# Altium project EL6905_2023-07-04T10_27_02_UTC.PrjPcb (part 3 of 3)
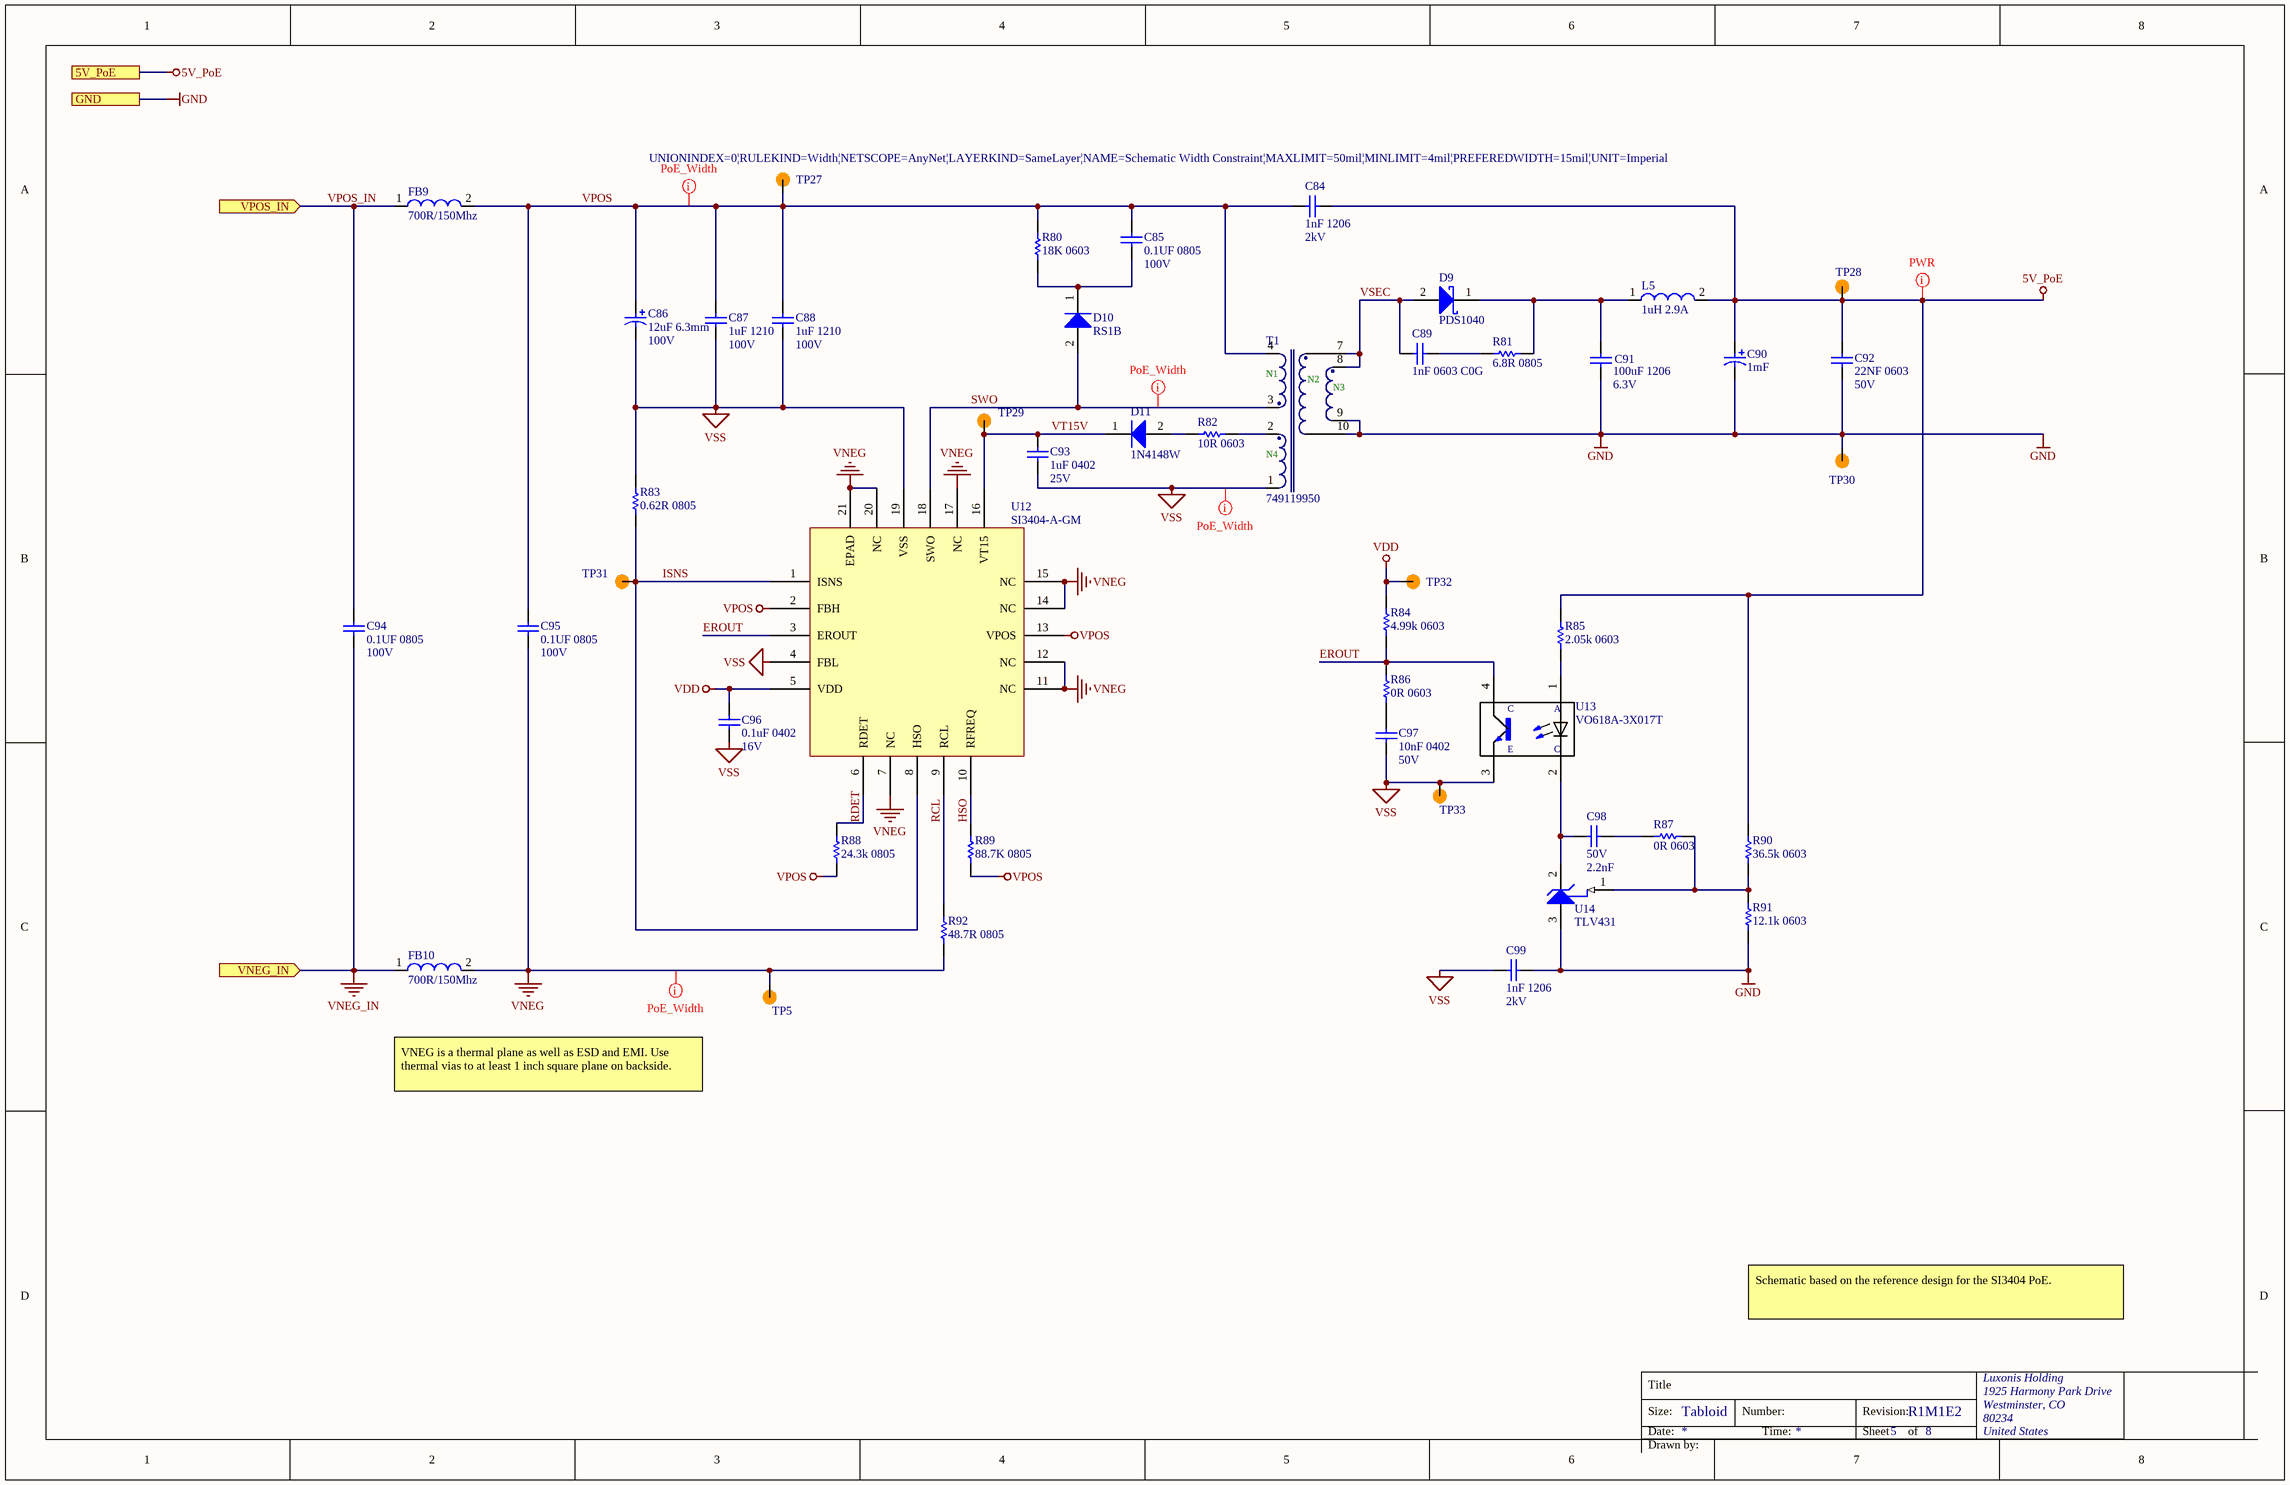
[diagram p9: POE_SI3404.SchDoc]

## Sheet POE_SI3404.SchDoc: =project_title (continued)

### Library data of the parts (continued)
R86 R87 = CRCW06030000Z0EA: RES SMD 0.0R OHM 1% 1/10W 0603; Manufacturer 1: Vishay; Manufacturer Part Number 1: CRCW0603-0000Z0EA; Resistance: 0mR; Power Rating: 100mW; Voltage Rating: 75V; Temperature Coefficient: 100ppm/°C; Tolerance: 5%; Current Rating: 2A; Supplier 1: Digi-Key; Stock 1: 742743; Pricing 1: 1=0.100000, 10=0.034000, 25=0.024400, 50=0.018600, 100=0.013800, 250=0.010480, 500=0.008400, 1000=0.006180 (USD); RoHS: Yes; Mount: Surface Mount; Case/Package: 0603; Weight: 7.1E-05oz; Contact Plating: Tin,Lead; Case Code (Metric): 1608; Case Code (Imperial): 0603; Min Operating Temperature: -55°C; Max Operating Temperature: 155°C; Composition: Thick Film; Termination: SMD/SMT; Packaging: Tape and Reel; Package Quantity: 1; Number of Terminations: 2; Military Standard: Not; Max Power Dissipation: 100mW; Voltage Rating (DC): 75V; Features: Automotive AEC-Q200; Working Voltage: 75V; Length: 1.55mm; Height: 0.02inch; Width: 0.033inch; Depth: 0.85mm; Radiation Hardening: No; Lead Free: Lead Free; REACH SVHC: Unknown; ComponentLink1URL: https://datasheet.ciiva.com/2461/dcrcwe3-2461968.pdf?src-supplier=Digi-Key; ComponentLink1Description: https://datasheet.ciiva.com/2461/dcrcwe3-2461968.pdf?src-supplier=Digi-Key; ComponentLink2URL: https://datasheet.ciiva.com/2461/dcrcwe3-2461969.pdf?src-supplier=Digi-Key; ComponentLink2Description: https://datasheet.ciiva.com/2461/dcrcwe3-2461969.pdf?src-supplier=Digi-Key; ComponentLink3URL: https://datasheet.ciiva.com/2461/dcrcwe3-2461970.pdf?src-supplier=Digi-Key; ComponentLink3Description: https://datasheet.ciiva.com/2461/dcrcwe3-2461970.pdf?src-supplier=Digi-Key; ComponentLink4URL: https://datasheet.ciiva.com/8340/dcrcwe3-8340197.pdf?src-supplier=Avnet; ComponentLink4Description: https://datasheet.ciiva.com/8340/dcrcwe3-8340197.pdf?src-supplier=Avnet; ComponentLink5URL: https://datasheet.ciiva.com/16941/dcrcw-16941302.pdf?src-supplier=Avnet+Europe; ComponentLink5Description: https://datasheet.ciiva.com/16941/dcrcw-16941302.pdf?src-supplier=Avnet+Europe; ComponentLink6URL: https://datasheet.ciiva.com/16199/dcrcwe3-16199063.pdf?src-supplier=Future+Electronics; ComponentLink6Description: https://datasheet.ciiva.com/16199/dcrcwe3-16199063.pdf?src-supplier=Future+Electronics; ComponentLink7URL: https://datasheet.ciiva.com/16725/70201119-16725175.pdf?src-supplier=Allied+Electronics; ComponentLink7Description: https://datasheet.ciiva.com/16725/70201119-16725175.pdf?src-supplier=Allied+Electronics; ComponentLink8URL: https://datasheet.ciiva.com/26316/fld-crcw-e3-data-en-26316615.pdf?src-supplier=Distrelec; ComponentLink8Description: https://datasheet.ciiva.com/26316/fld-crcw-e3-data-en-26316615.pdf?src-supplier=Distrelec; ComponentLink9URL: https://datasheet.ciiva.com/5544/dcrcwe3-109170-5544344.pdf?src-supplier=Mouser; ComponentLink9Description: https://datasheet.ciiva.com/5544/dcrcwe3-109170-5544344.pdf?src-supplier=Mouser; ComponentLink10URL: https://datasheet.ciiva.com/7841/1720486-7841816.pdf?src-supplier=Element14; ComponentLink10Description: https://datasheet.ciiva.com/7841/1720486-7841816.pdf?src-supplier=Element14; ComponentLink11URL: https://datasheet.ciiva.com/7841/1720486-7841817.pdf?src-supplier=Element14; ComponentLink11Description: https://datasheet.ciiva.com/7841/1720486-7841817.pdf?src-supplier=Element14; ComponentLink12URL: https://datasheet.ciiva.com/7841/125364-7841818.pdf?src-supplier=Element14; ComponentLink12Description: https://datasheet.ciiva.com/7841/125364-7841818.pdf?src-supplier=Element14; ComponentLink13URL: https://datasheet.ciiva.com/16721/70201119-16721450.pdf?src-supplier=Allied+Electronics; ComponentLink13Description: https://datasheet.ciiva.com/16721/70201119-16721450.pdf?src-supplier=Allied+Electronics; Supplier Part Number 1: 541-0.0GCT-ND
R88 = CRCW080524K3FKEA: RES SMD 24.3K OHM 1% 1/8W 0805; Manufacturer 1: Vishay; Resistance: 24.3kR; Temperature Coefficient: 100ppm/°C; Power Rating: 125mW; Voltage Rating: 150V; Supplier 1: Digi-Key; Manufacturer Part Number 1: CRCW080524K3FKEA; Stock 1: 7150; Pricing 1: 1=0.10000, 10=0.06200, 100=0.02540, 1000=0.01142, 2500=0.00991 (USD); RoHS: Yes; Mount: Surface Mount; Case/Package: 0805; Number of Pins: 2; Weight: 0.000194oz; Contact Plating: Tin; Case Code (Imperial): 0805; Case Code (Metric): 2012; Min Operating Temperature: -55°C; Max Operating Temperature: 155°C; Tolerance: 1%; Packaging: Tape and Reel; Composition: Thick Film; Package Quantity: 10; Termination: SMD/SMT; Number of Terminations: 2; Max Power Dissipation: 125mW; Features: Automotive AEC-Q200; Military Standard: Not; Voltage Rating (DC): 150V; Working Voltage: 150V; Length: 2mm; Height: 0.45mm; Width: 1.25mm; Depth: 1.25mm; Radiation Hardening: No; Lead Free: Lead Free; REACH SVHC: Unknown; ComponentLink1URL: https://datasheet.ciiva.com/11811/0900766b80d98b26-11811485.pdf?src-supplier=RSComponents; ComponentLink1Description: https://datasheet.ciiva.com/11811/0900766b80d98b26-11811485.pdf?src-supplier=RSComponents; ComponentLink2URL: https://datasheet.ciiva.com/5544/dcrcwe3-109170-5544277.pdf?src-supplier=Mouser; ComponentLink2Description: https://datasheet.ciiva.com/5544/dcrcwe3-109170-5544277.pdf?src-supplier=Mouser; ComponentLink3URL: https://datasheet.ciiva.com/2467/dcrcwe3-2467350.pdf?src-supplier=Digi-Key; ComponentLink3Description: https://datasheet.ciiva.com/2467/dcrcwe3-2467350.pdf?src-supplier=Digi-Key; ComponentLink4URL: https://datasheet.ciiva.com/3258/dcrcwe3-3258365.pdf?src-supplier=Avnet; ComponentLink4Description: https://datasheet.ciiva.com/3258/dcrcwe3-3258365.pdf?src-supplier=Avnet; ComponentLink5URL: https://datasheet.ciiva.com/2467/dcrcwe3-2467351.pdf?src-supplier=Digi-Key; ComponentLink5Description: https://datasheet.ciiva.com/2467/dcrcwe3-2467351.pdf?src-supplier=Digi-Key; ComponentLink6URL: https://datasheet.ciiva.com/2467/dcrcwe3-2467352.pdf?src-supplier=Digi-Key; ComponentLink6Description: https://datasheet.ciiva.com/2467/dcrcwe3-2467352.pdf?src-supplier=Digi-Key; ComponentLink7URL: https://datasheet.ciiva.com/22872/70201119-22872331.pdf?src-supplier=Allied+Electronics; ComponentLink7Description: https://datasheet.ciiva.com/22872/70201119-22872331.pdf?src-supplier=Allied+Electronics; ComponentLink8URL: https://datasheet.ciiva.com/3258/dcrcwe3-3258364.pdf?src-supplier=Avnet; ComponentLink8Description: https://datasheet.ciiva.com/3258/dcrcwe3-3258364.pdf?src-supplier=Avnet; ComponentLink9URL: https://datasheet.ciiva.com/17183/dcrcwe3-17183388.pdf?src-supplier=Avnet+Europe; ComponentLink9Description: https://datasheet.ciiva.com/17183/dcrcwe3-17183388.pdf?src-supplier=Avnet+Europe; ComponentLink10URL: https://datasheet.ciiva.com/22705/1697337-22705870.pdf?src-supplier=Element14; ComponentLink10Description: https://datasheet.ciiva.com/22705/1697337-22705870.pdf?src-supplier=Element14; ComponentLink11URL: https://datasheet.ciiva.com/16202/dcrcwe3-16202447.pdf?src-supplier=Future+Electronics; ComponentLink11Description: https://datasheet.ciiva.com/16202/dcrcwe3-16202447.pdf?src-supplier=Future+Electronics; Supplier 2: Newark; Supplier 3: Mouser; Supplier Part Number 1: 541-24.3KCCT-ND; Supplier Part Number 2: 53K0042; Supplier Part Number 3: 71-CRCW0805-24.3K-E3
R89 = CRCW080588K7FKEA: RES SMD 88.7K OHM 1% 1/8W 0805; Manufacturer 1: Vishay; Resistance: 88.7kR; Temperature Coefficient: 100ppm/°C; Max Power Dissipation: 125mW; Voltage Rating (DC): 150V; Supplier 1: Digi-Key; Manufacturer Part Number 1: CRCW080588K7FKEA; Stock 1: 5728; Pricing 1: 1=0.10000, 10=0.06200, 100=0.02540, 1000=0.01142, 2500=0.00991 (USD); RoHS: Yes; Case/Package: 0805; Number of Pins: 2; Weight: 0.000194oz; Contact Plating: Tin; Case Code (Metric): 2012; Case Code (Imperial): 0805; Min Operating Temperature: -55°C; Max Operating Temperature: 155°C; Tolerance: 1%; Packaging: Tape and Reel; Composition: Thick Film; Package Quantity: 10; Number of Terminations: 2; Features: Automotive AEC-Q200; Termination: SMD/SMT; Power Rating: 125mW; Voltage Rating: 150V; Length: 0.079inch; Height: 0.02inch; Width: 0.049inch; Height - Seated (Max): 0.02inch; Radiation Hardening: No; Lead Free: Lead Free; REACH SVHC: Unknown; ComponentLink1URL: https://datasheet.ciiva.com/7816/1697337-7816134.pdf?src-supplier=Element14; ComponentLink1Description: https://datasheet.ciiva.com/7816/1697337-7816134.pdf?src-supplier=Element14; ComponentLink2URL: https://datasheet.ciiva.com/2496/dcrcwe3-2496001.pdf?src-supplier=Digi-Key; ComponentLink2Description: https://datasheet.ciiva.com/2496/dcrcwe3-2496001.pdf?src-supplier=Digi-Key; ComponentLink3URL: https://datasheet.ciiva.com/2496/dcrcwe3-2496002.pdf?src-supplier=Digi-Key; ComponentLink3Description: https://datasheet.ciiva.com/2496/dcrcwe3-2496002.pdf?src-supplier=Digi-Key; ComponentLink4URL: https://datasheet.ciiva.com/2496/dcrcwe3-2496003.pdf?src-supplier=Digi-Key; ComponentLink4Description: https://datasheet.ciiva.com/2496/dcrcwe3-2496003.pdf?src-supplier=Digi-Key; ComponentLink5URL: https://datasheet.ciiva.com/7816/1697337-7816135.pdf?src-supplier=Element14; ComponentLink5Description: https://datasheet.ciiva.com/7816/1697337-7816135.pdf?src-supplier=Element14; ComponentLink6URL: https://datasheet.ciiva.com/22705/1697337-22705887.pdf?src-supplier=Element14; ComponentLink6Description: https://datasheet.ciiva.com/22705/1697337-22705887.pdf?src-supplier=Element14; Supplier 2: Newark; Supplier 3: Mouser; Supplier Part Number 2: 53K0521; Supplier Part Number 1: 541-88.7KCCT-ND; Supplier Part Number 3: 71-CRCW0805-88.7K-E3
R90 = RC0603FR-0736K5L: RES SMD 36.5K OHM 1% 1/10W 0603; Manufacturer 1: Yageo; Resistance: 36.5kR; Power Rating: 100mW; Voltage Rating: 50V; Temperature Coefficient: 100ppm/°C; Working Voltage: 75V; Supplier 1: Digi-Key; Manufacturer Part Number 1: RC0603FR-0736K5L; Stock 1: 763857; Pricing 1: 1=0.10000, 10=0.02300, 100=0.00940, 1000=0.00421, 2500=0.00366 (USD); RoHS: Yes; Case/Package: 0603; Case Code (Metric): 1608; Case Code (Imperial): 0603; Min Operating Temperature: -55°C; Max Operating Temperature: 155°C; Package Quantity: 1; Tolerance: 1%; Packaging: Tape and Reel; Composition: Thick Film; Number of Terminations: 2; Termination: SMD/SMT; Military Standard: Not; Max Power Dissipation: 100mW; Voltage Rating (DC): 50V; Features: Moisture Resistant; Length: 0.063inch; Height: 0.022inch; Width: 0.031inch; Depth: 0.8mm; Lead Free: Lead Free; ComponentLink1URL: https://datasheet.ciiva.com/2491/pyu-r-int-thick-7-2491306.pdf?src-supplier=Digi-Key; ComponentLink1Description: https://datasheet.ciiva.com/2491/pyu-r-int-thick-7-2491306.pdf?src-supplier=Digi-Key; ComponentLink2URL: https://datasheet.ciiva.com/2491/pyu-r-int-thick-7-2491307.pdf?src-supplier=Digi-Key; ComponentLink2Description: https://datasheet.ciiva.com/2491/pyu-r-int-thick-7-2491307.pdf?src-supplier=Digi-Key; ComponentLink3URL: https://datasheet.ciiva.com/2491/pyu-r-int-thick-7-2491308.pdf?src-supplier=Digi-Key; ComponentLink3Description: https://datasheet.ciiva.com/2491/pyu-r-int-thick-7-2491308.pdf?src-supplier=Digi-Key; Supplier 2: Mouser; Supplier 3: Future Electronics; Supplier Part Number 1: 311-36.5KHRCT-ND; Supplier Part Number 2: 603-RC0603FR-0736K5L; Supplier Part Number 3: RC0603FR-0736K5L-CUTT
R91 = RC0603FR-0712K1L: RES SMD 12.1K OHM 1% 1/10W 0603; Manufacturer 1: Yageo; Power Rating: 100mW; Temperature Coefficient: 100ppm/°C; Resistance: 12.1kR; Voltage Rating: 50V; Supplier 1: Digi-Key; Manufacturer Part Number 1: RC0603FR-0712K1L; Stock 1: 267774; Pricing 1: 1=0.10000, 10=0.02300, 100=0.00940, 1000=0.00421, 2500=0.00366 (USD); RoHS: Yes; Case/Package: 0603; Number of Pins: 2; Case Code (Metric): 1608; Case Code (Imperial): 0603; Min Operating Temperature: -55°C; Max Operating Temperature: 155°C; Tolerance: 1%; Package Quantity: 1; Packaging: Tape and Reel; Composition: Thick Film; Number of Terminations: 2; Termination: SMD/SMT; Military Standard: Not; Max Power Dissipation: 100mW; Voltage Rating (DC): 50V; Features: Moisture Resistant; Length: 1.6mm; Height: 0.022inch; Depth: 0.8mm; Width: 0.031inch; REACH SVHC: No SVHC; Lead Free: Lead Free; ComponentLink1URL: https://datasheet.ciiva.com/2519/pyu-r-int-thick-7-2519216.pdf?src-supplier=Digi-Key; ComponentLink1Description: https://datasheet.ciiva.com/2519/pyu-r-int-thick-7-2519216.pdf?src-supplier=Digi-Key; ComponentLink2URL: https://datasheet.ciiva.com/2519/pyu-r-int-thick-7-2519217.pdf?src-supplier=Digi-Key; ComponentLink2Description: https://datasheet.ciiva.com/2519/pyu-r-int-thick-7-2519217.pdf?src-supplier=Digi-Key; ComponentLink3URL: https://datasheet.ciiva.com/2519/pyu-r-int-thick-7-2519218.pdf?src-supplier=Digi-Key; ComponentLink3Description: https://datasheet.ciiva.com/2519/pyu-r-int-thick-7-2519218.pdf?src-supplier=Digi-Key; ComponentLink4URL: https://datasheet.ciiva.com/15159/getdatasheetpartid-28802-15159207.pdf?src-supplier=Verical; ComponentLink4Description: https://datasheet.ciiva.com/15159/getdatasheetpartid-28802-15159207.pdf?src-supplier=Verical; ComponentLink5URL: https://datasheet.ciiva.com/12558/rc0603-272842-12558574.pdf?src-supplier=Mouser; ComponentLink5Description: https://datasheet.ciiva.com/12558/rc0603-272842-12558574.pdf?src-supplier=Mouser; ComponentLink6URL: https://datasheet.ciiva.com/46395/443971-46395022.pdf?src-supplier=Element14; ComponentLink6Description: https://datasheet.ciiva.com/46395/443971-46395022.pdf?src-supplier=Element14; Supplier 2: Newark; Supplier 3: Mouser; Supplier Part Number 3: 603-RC0603FR-0712K1L; Supplier Part Number 2: 66R2021; Supplier Part Number 1: 311-12.1KHRCT-ND
R92 = RC0805FR-0748R7L: RES SMD 48.7 OHM 1% 1/8W 0805; Manufacturer 1: Yageo; Temperature Coefficient: 100ppm/°C; Power Rating: 125mW; Voltage Rating: 150V; Supplier 1: Digi-Key; Manufacturer Part Number 1: RC0805FR-0748R7L; Stock 1: 11096; Pricing 1: 1=0.10000, 10=0.04000, 100=0.01630, 1000=0.00731, 2500=0.00635 (USD); RoHS: Yes; Case/Package: 0805; Contact Plating: Tin,Matte; Case Code (Metric): 2012; Case Code (Imperial): 0805; Min Operating Temperature: -55°C; Max Operating Temperature: 155°C; Resistance: 48.7R; Tolerance: 1%; Composition: Thick Film; Package Quantity: 1; Packaging: Tape and Reel; Number of Terminations: 2; Termination: SMD/SMT; Military Standard: Not; Max Power Dissipation: 125mW; Voltage Rating (DC): 150V; Features: Moisture Resistant; Length: 2mm; Height: 0.024inch; Width: 0.049inch; Depth: 1.25mm; Radiation Hardening: No; Lead Free: Lead Free; ComponentLink1URL: https://datasheet.ciiva.com/2457/pyu-r-int-thick-7-2457344.pdf?src-supplier=Digi-Key; ComponentLink1Description: https://datasheet.ciiva.com/2457/pyu-r-int-thick-7-2457344.pdf?src-supplier=Digi-Key; ComponentLink2URL: https://datasheet.ciiva.com/2457/pyu-r-int-thick-7-2457345.pdf?src-supplier=Digi-Key; ComponentLink2Description: https://datasheet.ciiva.com/2457/pyu-r-int-thick-7-2457345.pdf?src-supplier=Digi-Key; ComponentLink3URL: https://datasheet.ciiva.com/2457/pyu-r-int-thick-7-2457346.pdf?src-supplier=Digi-Key; ComponentLink3Description: https://datasheet.ciiva.com/2457/pyu-r-int-thick-7-2457346.pdf?src-supplier=Digi-Key; Supplier 2: Mouser; Supplier 3: Arrow; Supplier Part Number 1: 311-48.7CRCT-ND; Supplier Part Number 2: 603-RC0805FR-0748R7L; Supplier Part Number 3: RC0805FR-0748R7L
T1 = 749119950: TRANS FLYBACK POE 127UH SMD; Manufacturer 1: Wurth Electronics; Current Rating: 1.3A; Power Rating: 13W; Max Input Voltage: 57V; Min Input Voltage: 36V; Output Voltage: 5V; Frequency: 500kHz; ComponentLink2URL: http://www.we-online.de/katalog/media/pdf/749119950.pdf; ComponentLink2Description: Datasheet; ComponentLink1Description: Manufacturer URL; ComponentLink1URL: http://www.we-online.com; Supplier 1: Digi-Key; Manufacturer Part Number 1: 749119950; Stock 1: 148; Pricing 1: 1=5.64000, 10=5.44300, 50=5.14100, 100=4.83800 (USD); RoHS: Yes; Mount: Surface Mount; Case/Package: SMD/SMT; Min Operating Temperature: -40°C; Max Operating Temperature: 125°C; Package Quantity: 1; Packaging: Tape and Reel; Inductance: 127uH; Length: 13.5mm; Height: 12.5mm; Width: 17.75mm; Height - Seated (Max): 12.5mm; REACH SVHC: No SVHC; ComponentLink3URL: https://datasheet.ciiva.com/1378/749119950-1378246.pdf?src-supplier=Element14; ComponentLink3Description: https://datasheet.ciiva.com/1378/749119950-1378246.pdf?src-supplier=Element14; ComponentLink4URL: https://datasheet.ciiva.com/5309/749119950-91646-5309801.pdf?src-supplier=Mouser; ComponentLink4Description: https://datasheet.ciiva.com/5309/749119950-91646-5309801.pdf?src-supplier=Mouser; ComponentLink5URL: https://datasheet.ciiva.com/1386/749119950-1386647.pdf?src-supplier=Farnell; ComponentLink5Description: https://datasheet.ciiva.com/1386/749119950-1386647.pdf?src-supplier=Farnell; ComponentLink6URL: https://datasheet.ciiva.com/2940/749119950-2940138.pdf?src-supplier=Digi-Key; ComponentLink6Description: https://datasheet.ciiva.com/2940/749119950-2940138.pdf?src-supplier=Digi-Key; ComponentLink7URL: https://datasheet.ciiva.com/2940/749119950-2940139.pdf?src-supplier=Digi-Key; ComponentLink7Description: https://datasheet.ciiva.com/2940/749119950-2940139.pdf?src-supplier=Digi-Key; Supplier 2: Digi-Key; Supplier 3: Mouser; Supplier Part Number 1: 732-2432-1-ND; Supplier Part Number 2: 732-2432-6-ND; Supplier Part Number 3: 710-749119950
TP5 TP27-TP33 = CMP-015-000000-2: Manufacturer Part Number 1: /; Source: LuxonisMaster.SchLib; Design Item ID: TEST_POINT
U12 = SI3404-A-GM: IC POE CNTRL 1 CHANNEL 20QFN; Manufacturer 1: Silicon Labs; Supplier 1: Digi-Key; Manufacturer Part Number 1: SI3404-A-GM; Stock 1: 1481; Pricing 1: 1=1.46000, 25=1.41040, 100=1.35600, 1000=1.33340 (USD); RoHS: No; ComponentLink1URL: https://www.silabs.com/documents/public/data-sheets/si3404-datasheet.pdf?src-supplier=Digi-Key; ComponentLink1Description: https://www.silabs.com/documents/public/data-sheets/si3404-datasheet.pdf?src-supplier=Digi-Key; Supplier 2: Mouser; Supplier Part Number 1: 336-4270-ND; Supplier Part Number 2: 634-SI3404-A-GM
U13 = VO618A-3X017T: OPTOISOLATOR 5.3KV TRANS 4-SMD; Manufacturer 1: Vishay Semiconductors; Max Power Dissipation: 150mW; Collector Emitter Voltage (VCEO): 80V; Collector Emitter Saturation Voltage: 400mV; Max Collector Current: 50mA; Max Input Current: 60mA; Number of Channels: 1; Reverse Breakdown Voltage: 6V; Forward Voltage: 1.1V; Current Transfer Ratio: 100%; Supplier 1: Digi-Key; Manufacturer Part Number 1: VO618A-3X017T; Stock 1: 28306; Pricing 1: 1=1.04000, 10=0.80900, 100=0.51980, 500=0.43890 (USD); RoHS: Yes; Mount: Surface Mount; Case/Package: SMD/SMT; Number of Pins: 4; Contact Plating: Tin; Min Operating Temperature: -55°C; Max Operating Temperature: 110°C; Packaging: Tape and Reel; Package Quantity: 1; Forward Current: 60mA; Max Output Voltage: 80V; Output Current per Channel: 50mA; Isolation Voltage: 5.3kV; Number of Elements: 1; Power Dissipation: 150mW; Input Current: 60mA; Radiation Hardening: No; REACH SVHC: Unknown; Lead Free: Lead Free; ComponentLink1URL: https://datasheet.ciiva.com/26183/vo618a-26183397.pdf?src-supplier=Avnet+Europe; ComponentLink1Description: https://datasheet.ciiva.com/26183/vo618a-26183397.pdf?src-supplier=Avnet+Europe; ComponentLink2URL: https://datasheet.ciiva.com/2087/vo618a-2087431.pdf?src-supplier=Digi-Key; ComponentLink2Description: https://datasheet.ciiva.com/2087/vo618a-2087431.pdf?src-supplier=Digi-Key; ComponentLink3URL: https://datasheet.ciiva.com/2087/vo618a-2087432.pdf?src-supplier=Digi-Key; ComponentLink3Description: https://datasheet.ciiva.com/2087/vo618a-2087432.pdf?src-supplier=Digi-Key; ComponentLink4URL: https://datasheet.ciiva.com/2087/vo618a-2087433.pdf?src-supplier=Digi-Key; ComponentLink4Description: https://datasheet.ciiva.com/2087/vo618a-2087433.pdf?src-supplier=Digi-Key; Supplier 2: Newark; Supplier 3: Mouser; Supplier Part Number 1: VO618A-3X017TCT-ND; Supplier Part Number 2: 48W3695; Supplier Part Number 3: 78-VO618A-3X017T
U14 = TLV431BCDBZR: IC VREF SHUNT ADJ SOT23-3; Manufacturer 1: Texas Instruments; Tolerance: 0.5%; Max Input Voltage: 7V; Output Voltage: 6V; Max Output Current: 15mA; Temperature Coefficient: 129ppm/°C; Cathode Current: 100uA; Reference Type: Shunt,Adjustable; Number of Channels: 1; Min Input Voltage: 1.24V; Supplier 1: Digi-Key; Manufacturer Part Number 1: TLV431BCDBZR; Stock 1: 3209; Pricing 1: 1=0.92000, 10=0.81200, 100=0.57850, 500=0.46772, 1000=0.35695 (USD); RoHS: Yes; Case/Package: SOT-23; Number of Pins: 3; Min Operating Temperature: -40°C; Max Operating Temperature: 125°C; Packaging: Tape and Reel; Package Quantity: 1; Output Current: 15mA; Max Output Voltage: 6V; Reference Voltage: 6V; Radiation Hardening: No; Lead Free: Lead Free; REACH SVHC: No SVHC; ComponentLink1URL: https://datasheet.ciiva.com/26889/tlv431bcdbzr-26889546.pdf?src-supplier=IIIC; ComponentLink1Description: https://datasheet.ciiva.com/26889/tlv431bcdbzr-26889546.pdf?src-supplier=IIIC; ComponentLink2URL: https://datasheet.ciiva.com/2006/tlv431a-2006546.pdf?src-supplier=Digi-Key; ComponentLink2Description: https://datasheet.ciiva.com/2006/tlv431a-2006546.pdf?src-supplier=Digi-Key; ComponentLink3URL: https://datasheet.ciiva.com/2006/tlv431a-2006547.pdf?src-supplier=Digi-Key; ComponentLink3Description: https://datasheet.ciiva.com/2006/tlv431a-2006547.pdf?src-supplier=Digi-Key; ComponentLink4URL: https://datasheet.ciiva.com/2006/tlv431a-2006548.pdf?src-supplier=Digi-Key; ComponentLink4Description: https://datasheet.ciiva.com/2006/tlv431a-2006548.pdf?src-supplier=Digi-Key; ComponentLink5URL: https://datasheet.ciiva.com/26264/tlv431b-26264234.pdf?src-supplier=Avnet+Europe; ComponentLink5Description: https://datasheet.ciiva.com/26264/tlv431b-26264234.pdf?src-supplier=Avnet+Europe; ComponentLink6URL: https://datasheet.ciiva.com/46397/1887487-46397709.pdf?src-supplier=Element14; ComponentLink6Description: https://datasheet.ciiva.com/46397/1887487-46397709.pdf?src-supplier=Element14; Supplier 2: TI store; Supplier 3: Mouser; Supplier Part Number 1: 296-17569-1-ND; Supplier Part Number 2: TLV431BCDBZR; Supplier Part Number 3: 595-TLV431BCDBZR

## Sheet M8_AUX_CONN.SchDoc: =project_title
size Tabloid; CompanyName: Luxonis Holding; DrawnBy: Eason Lin; Organization: Luxonis Holding; Address1: 1925 Harmony Park Drive; Address2: Westminster, CO; Address3: 80234; Address4: United States; DocumentNumber: D2088000; Revision: R1M1E2; SheetNumber: 8; SheetTotal: 8
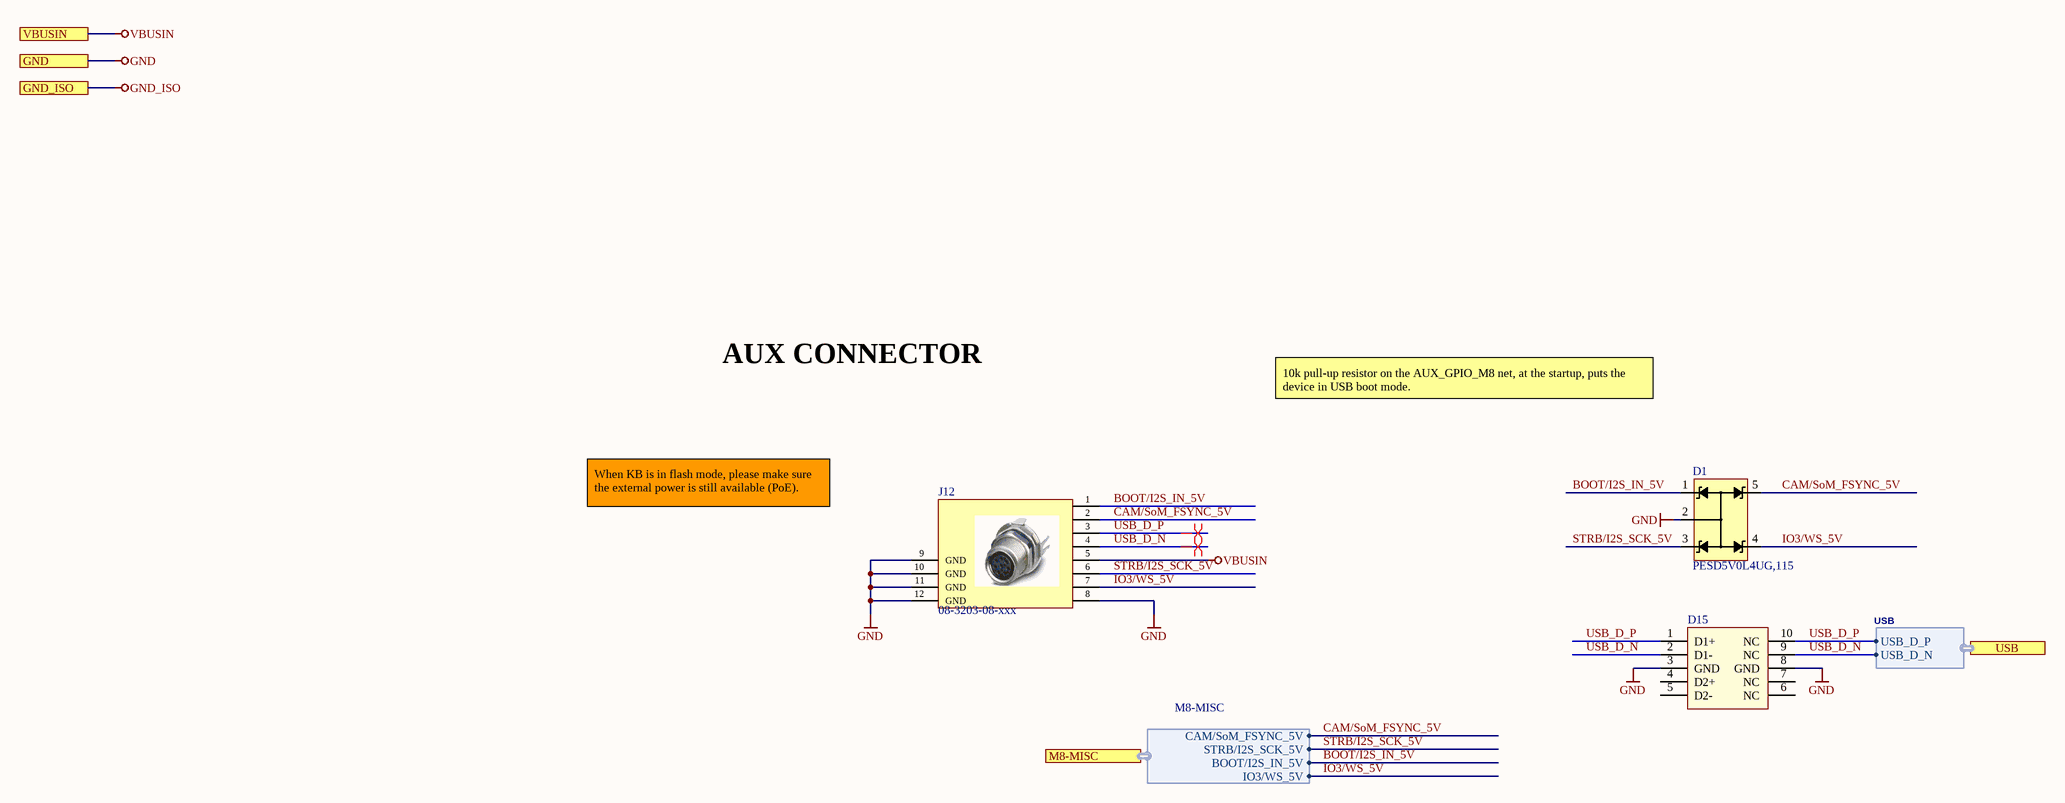
[diagram p4: M8_AUX_CONN.SchDoc]

### Parts
D1  PESD5V0L4UG,115  [PESD3V3L4UG,115]
D15  TPD4EUSB30DQAR  [TPD4EUSB30DQAR]  (value not drawn)
J12  08-3203-08-xxx  [08-3203-08-XXX]

### Ports
GND, GND_ISO, M8-MISC (harness M8-MISC), USB (harness USB), VBUSIN

### Harnesses
USB: USB_D_P, USB_D_N
M8-MISC: CAM/SoM_FSYNC_5V, STRB/I2S_SCK_5V, BOOT/I2S_IN_5V, IO3/WS_5V

### Nets
GND: D1.2 D15.3(GND) D15.8(GND) J12.8 J12.9(GND) J12.10(GND) J12.11(GND) J12.12(GND) ; port GND
GND_ISO: port GND_ISO
VBUSIN: J12.5 ; port VBUSIN
BOOT/I2S_IN_5V: D1.1 J12.1 ; port M8-MISC.BOOT/I2S_IN_5V
CAM/SoM_FSYNC_5V: D1.5 J12.2 ; port M8-MISC.CAM/SoM_FSYNC_5V
IO3/WS_5V: D1.4 J12.7 ; port M8-MISC.IO3/WS_5V
STRB/I2S_SCK_5V: D1.3 J12.6 ; port M8-MISC.STRB/I2S_SCK_5V
USB_D_N: D15.2(D1-) D15.9(NC) J12.4 ; port USB.USB_D_N
USB_D_P: D15.1(D1+) D15.10(NC) J12.3 ; port USB.USB_D_P

Not connected (* = marked no-connect by the designer): D15 4(D2+) 5(D2-) 6(NC) 7(NC)

### Layout directives
differential pair; net class USB2; differential pair class 90ohm: USB_D_N, USB_D_P

### Notes on the sheet
- AUX CONNECTOR
- 10k pull-up resistor on the AUX_GPIO_M8 net, at the startup, puts the device in USB boot mode.
- When KB is in flash mode, please make sure the external power is still available (PoE).
- Title
- Size:
- Date:
- Tabloid
- Number:
- Time:
- Revision:
- Sheet
- of
- Drawn by:

### Library data of the parts
D1 = CMP-097-000002-2: TVS DIODE 5V 12V 5TSSOP; Manufacturer 1: Nexperia; Manufacturer Part Number 1: PESD5V0L4UG,115; Category: ESD and Circuit Protection ICs
D15 = CMP-008-000011-2: TVS DIODE 5.5V 8V 10SON 8V Clamp 1A (8/20µs) Ipp Tvs Diode Surface Mount 10-USON (2.5x1); Manufacturer 1: Texas Instruments; Forward Current: 5A; Manufacturer Part Number 1: TPD4EUSB30DQAR; Min Operating Temperature: -40°C; Max Operating Temperature: 85°C; Clamping Voltage: 8V
J12 = CMP-002-00116-2: M8 Circular Connector; Manufacturer 1: KingTop; RoHS: Yes; Category: Circular Connectors; Contact Finish - Mating: NOT SPECIFIED; Connector Type: Circular; REACH SVHC: No SVHC; RoHS Compliant: Yes; ComponentLink1URL: https://datasheet.ciiva.com:443/pdfs/VipMasterIC/IC/PCON/PCON-S-A0001961096/PCON-S-A0001960825-1.pdf?src-supplier=IHS+Markit; ComponentLink1Description: https://datasheet.ciiva.com:443/pdfs/VipMasterIC/IC/PCON/PCON-S-A0001961096/PCON-S-A0001960825-1.pdf?src-supplier=IHS+Markit; ComponentLink2URL: https://datasheet.ciiva.com/29221/1456132-29221494.pdf?src-supplier=Digi-Key; ComponentLink2Description: https://datasheet.ciiva.com/29221/1456132-29221494.pdf?src-supplier=Digi-Key; ComponentLink3URL: https://datasheet.ciiva.com/41451/718258-da-01-de-sens-akt-einbaubuch-6pol-1456132-20-st-41451463.pdf?src-supplier=Conrad; ComponentLink3Description: https://datasheet.ciiva.com/41451/718258-da-01-de-sens-akt-einbaubuch-6pol-1456132-20-st-41451463.pdf?src-supplier=Conrad; Manufacturer Part Number 1: 08-3203-08-XXX; Stock 1: 11; Pricing 1: 1=26,56000, 10=24,43500, 50=22,57600, 100=21,51360, 250=20,18568 (USD); Design Item ID: 08-3203-08-xxx; Source: NG9097.SchLib; Pins: 8

## Sheet BTB_CONN.SchDoc: =project_title
size Tabloid; CompanyName: Luxonis Holding; DrawnBy: Eason Lin; Organization: Luxonis Holding; Address1: 1925 Harmony Park Drive; Address2: Westminster, CO; Address3: 80234; Address4: United States; DocumentNumber: D2088000; Revision: R1M1E2; SheetNumber: 3; SheetTotal: 8
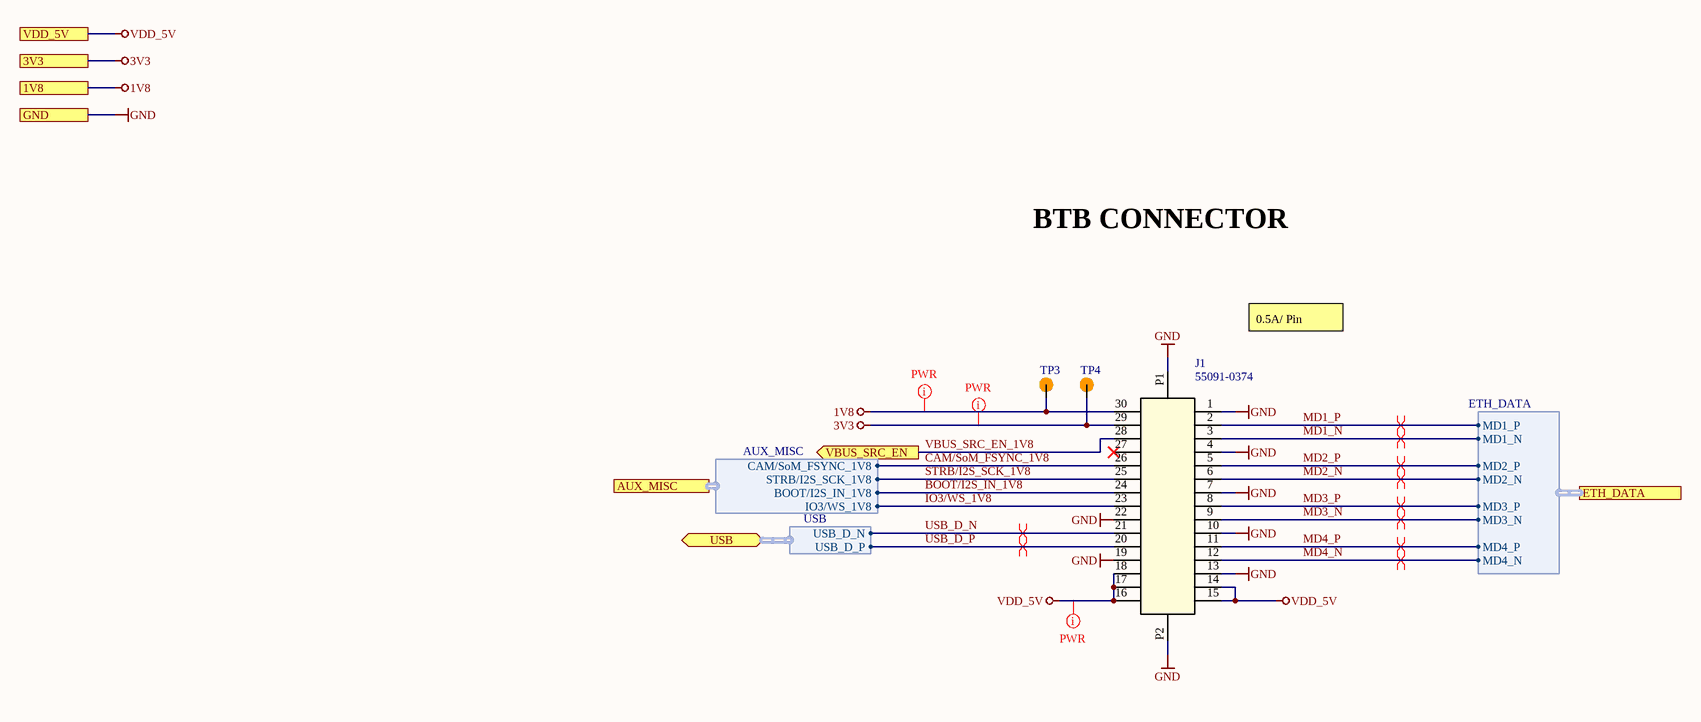
[diagram p5: BTB_CONN.SchDoc]

### Parts
J1  55091-0374  [CON_550910374]
TP3  TP100_200_NS  [TP075_150_NS]  (value not drawn)  (no BOM)
TP4  TP100_200_NS  [TP075_150_NS]  (value not drawn)  (no BOM)

### Ports
1V8, 3V3, AUX_MISC (harness AUX_MISC), ETH_DATA (harness ETH_DATA), GND, USB (bidir, harness USB), VBUS_SRC_EN (out), VDD_5V

### Harnesses
ETH_DATA: MD1_P, MD1_N, MD2_P, MD2_N, MD3_P, MD3_N, MD4_P, MD4_N
USB: USB_D_P, USB_D_N
AUX_MISC: CAM/SoM_FSYNC_1V8, STRB/I2S_SCK_1V8, BOOT/I2S_IN_1V8, IO3/WS_1V8

### Nets
1V8: J1.30 TP3.1 ; port 1V8
3V3: J1.29 TP4.1 ; port 3V3
GND: J1.1 J1.4 J1.7 J1.10 J1.13 J1.19 J1.22 J1.P1 J1.P2 ; port GND
VDD_5V: J1.14 J1.15 J1.16 J1.17 J1.18 ; port VDD_5V
BOOT/I2S_IN_1V8: J1.24 ; port AUX_MISC.BOOT/I2S_IN_1V8
CAM/SoM_FSYNC_1V8: J1.26 ; port AUX_MISC.CAM/SoM_FSYNC_1V8
IO3/WS_1V8: J1.23 ; port AUX_MISC.IO3/WS_1V8
MD1_N: J1.3 ; port ETH_DATA.MD1_N
MD1_P: J1.2 ; port ETH_DATA.MD1_P
MD2_N: J1.6 ; port ETH_DATA.MD2_N
MD2_P: J1.5 ; port ETH_DATA.MD2_P
MD3_N: J1.9 ; port ETH_DATA.MD3_N
MD3_P: J1.8 ; port ETH_DATA.MD3_P
MD4_N: J1.12 ; port ETH_DATA.MD4_N
MD4_P: J1.11 ; port ETH_DATA.MD4_P
STRB/I2S_SCK_1V8: J1.25 ; port AUX_MISC.STRB/I2S_SCK_1V8
USB_D_N: J1.21 ; port USB.USB_D_N
USB_D_P: J1.20 ; port USB.USB_D_P
VBUS_SRC_EN_1V8: J1.28 ; port VBUS_SRC_EN

Not connected (* = marked no-connect by the designer): J1 27*

### Layout directives
differential pair; net class USB2; differential pair class 90ohm: USB_D_N, USB_D_P
differential pair; net class ETH; differential pair class 100ohm: MD1_N, MD1_P, MD2_N, MD2_P, MD3_N, MD3_P, MD4_N, MD4_P
net class PWR; Current Rating: 3A: VDD_5V
net class PWR; Current Rating: 100mA: 1V8, 3V3

### Notes on the sheet
- BTB CONNECTOR
- 0.5A/ Pin
- Title
- Size:
- Date:
- Tabloid
- Number:
- Time:
- Revision:
- Sheet
- of
- Drawn by:

### Library data of the parts
J1 = CMP-00021-4: CONN, Board-to-Board Connector, Mezzanine, 0.635mm pitch, 2x15, 30 positions, Receptacle, Mated height 12mm; Manufacturer 1: Molex; Max Current Rating: 500mA; Voltage Rating: 100V; Manufacturer Part Number 1: 55091-0374; Max Operating Temperature: 105°C; Connector Type: Mezzanine; Gender: Receptacle; Min Operating Temperature: -55°C; Pins: 30; System: Connector
TP3 TP4 = CMP-015-000000-2: Manufacturer Part Number 1: /; Source: LuxonisMaster.SchLib; Design Item ID: TEST_POINT

## Sheet POWER CONTROL.SchDoc: =project_title
size Tabloid; CompanyName: Luxonis Holding; DrawnBy: Eason Lin; Organization: Luxonis Holding; Address1: 1925 Harmony Park Drive; Address2: Westminster, CO; Address3: 80234; Address4: United States; DocumentNumber: D2088000; Revision: R1M1E2; SheetNumber: 4; SheetTotal: 8
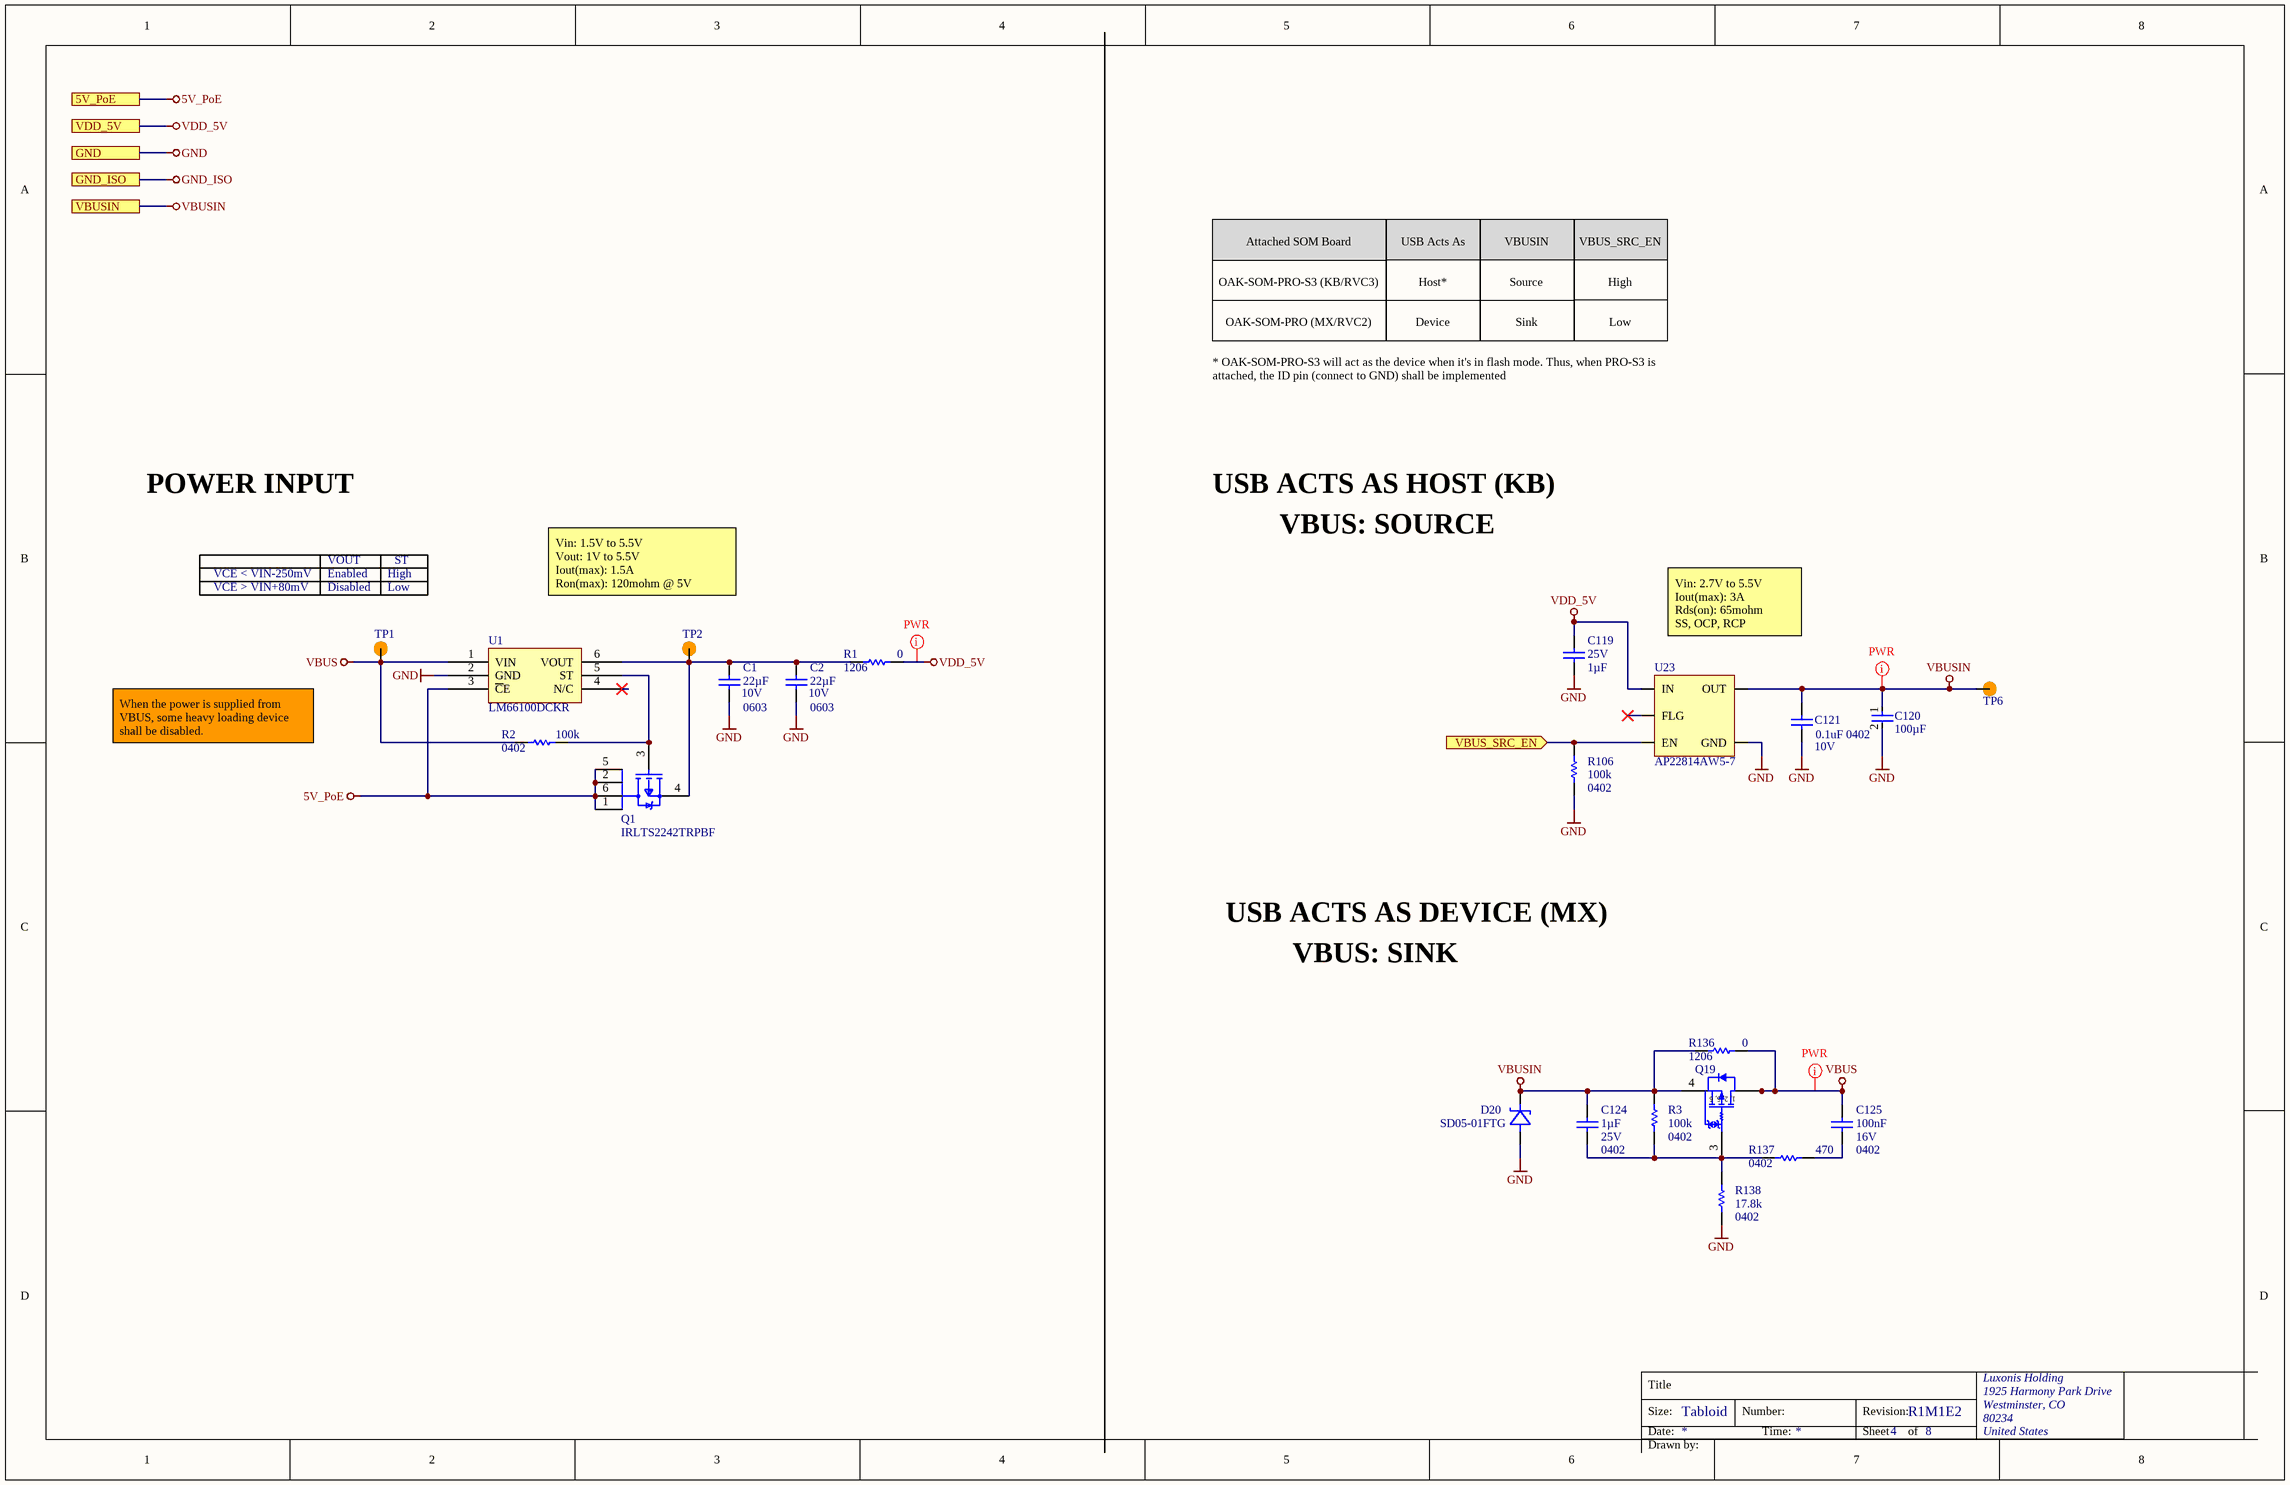
[diagram p6: POWER CONTROL.SchDoc]

### Parts
C1  value 22µF  Voltage Rating: 10V  Case/Package: 0603  [CAPC0603(1608)100_N]  (hidden comment: GRM188R61A226ME15D)
C2  value 22µF  Voltage Rating: 10V  Case/Package: 0603  [CAPC0603(1608)100_N]  (hidden comment: GRM188R61A226ME15D)
C119  value 1µF  Voltage Rating: 25V  [CAPC0402(1005)70_N]  (hidden comment: GRM155R61E105KA12D)
C120  value 100µF  [FP-C1210C107M8PACTU-MFG]  (hidden comment: C1210C107M8PACTU)
C121  0.1uF 0402  Voltage Rating: 10V  [CAPC0402(1005)70_N]
C124  value 1µF  Voltage Rating: 25V  Case/Package: 0402  [CAPC0402(1005)70_N]  (hidden comment: GRM155R61E105KA12D)
C125  value 100nF  Voltage Rating: 16V  Case/Package: 0402  [CAPC0402(1005)60_N]  (hidden comment: CL05B104KO5NFNC)
D20  SD05-01FTG  [SD05-01FTG-Footprint-1]
Q1  IRLTS2242TRPBF  [TSOP-6-MFG]
Q19  NTJS4151PT1G  [ONSC-SC70-6-419B-02_W_V]  (value not drawn)
R1  value 0  Case/Package: 1206  [RESC3116X70X50ML13T20]  (hidden comment: ERJ8GEY0R00V)
R2  value 100k  Case/Package: 0402  [RESC0402(1005)_L]  (hidden comment: RC0402FR-07100KL)
R3  value 100k  Case/Package: 0402  [RESC0402(1005)_L]  (hidden comment: RC0402FR-07100KL)
R106  value 100k  Case/Package: 0402  [RESC0402(1005)_L]  (hidden comment: RC0402FR-07100KL)
R136  value 0  Case/Package: 1206  [RESC3116X70X50ML13T20]  (hidden comment: ERJ8GEY0R00V)
R137  value 470  Case/Package: 0402  [RESC0402(1005)_L]  (hidden comment: CRCW0402470RFKED)
R138  value 17.8k  Case/Package: 0402  [RESC0402(1005)_L]  (hidden comment: ERJ-2RKF1782X)
TP1  TP100_200_NS  [TP075_150_NS]  (value not drawn)  (no BOM)
TP2  TP100_200_NS  [TP075_150_NS]  (value not drawn)  (no BOM)
TP6  TP100_200_NS  [TP075_150_NS]  (value not drawn)  (no BOM)
U1  LM66100DCKR  [LM66100DCKR]
U23  AP22814AW5-7  [AP22814AW5-7-Footprint-1]

### Ports
5V_PoE, GND, GND_ISO, VBUS_SRC_EN (in), VBUSIN, VDD_5V

### Nets
5V_PoE: Q1.1(D) Q1.2(D) Q1.5(D) Q1.6(D) U1.3(~{C}E) ; port 5V_PoE
GND: C1.1 C2.1 C119.1 C120.2 C121.1 D20.1 R106.2 R138.1 U1.2(GND) U23.2(GND) ; port GND
GND_ISO: port GND_ISO
VBUS: C125.2 Q19.1(D) Q19.2(D) Q19.5(D) Q19.6(D) R2.2 R136.2 TP1.1 U1.1(VIN)
VBUSIN: C120.1 C121.2 C124.2 D20.2 Q19.4(S) R3.2 R136.1 TP6.1 U23.1(OUT) ; port VBUSIN
VDD_5V: C119.2 R1.2 U23.5(IN) ; port VDD_5V
VBUS_SRC_EN_1V8: R106.1 U23.4(EN) ; port VBUS_SRC_EN
NetC1_2: C1.2 C2.2 Q1.4(S) R1.1 TP2.1 U1.6(VOUT)
NetC124_1: C124.1 Q19.3(G) R3.1 R137.1 R138.2
NetC125_1: C125.1 R137.2
NetQ1_3: Q1.3(G) R2.1 U1.5(ST)

Not connected (* = marked no-connect by the designer): U1 4(N/C)*; U23 3(FLG)*

### Layout directives
net class PWR; Current Rating: 1.5A: VBUS, VBUSIN
net class PWR; Current Rating: 3A: VDD_5V

### Notes on the sheet
- OAK-SOM-PRO-S3 (KB/RVC3)
- Attached SOM Board
- USB Acts As
- Host*
- VBUSIN
- Source
- VBUS_SRC_EN
- High
- OAK-SOM-PRO (MX/RVC2)
- Device
- Sink
- Low
- * OAK-SOM-PRO-S3 will act as the device when it's in flash mode. Thus, when PRO-S3 is attached, the ID pin (connect to GND) shall be implemented
- POWER INPUT
- USB ACTS AS HOST (KB)
- VOUT
- ST
- VBUS: SOURCE
- VCE < VIN-250mV
- VCE > VIN+80mV
- Enabled
- Disabled
- Vin: 1.5V to 5.5V
  Vout: 1V to 5.5V
  Iout(max): 1.5A
  Ron(max): 120mohm @ 5V
- Vin: 2.7V to 5.5V
  Iout(max): 3A
  Rds(on): 65mohm
  SS, OCP, RCP
- When the power is supplied from VBUS, some heavy loading device shall be disabled.
- USB ACTS AS DEVICE (MX)
- VBUS: SINK
- Title
- Size:
- Date:
- Tabloid
- Number:
- Time:
- Revision:
- Sheet
- of
- Drawn by:
- (in symbol CMP-061-000004-2) 1, 2, 5, 6

### Library data of the parts
C1 C2 = CMP-108-000020-4: CAP CER 22UF 10V X5R 0603 20%; Manufacturer 1: Murata; Tolerance: 20%; Max Operating Temperature: 85°C; ComponentLink1Description: https://datasheet.ciiva.com/46444/1769893-46444975.pdf?src-supplier=Element14; Min Operating Temperature: -55°C; Manufacturer Part Number 1: GRM188R61A226ME15D; Mounting Technology: SMT; Depth: 0.8mm; Design Item ID: GRM188R61A226ME15D; Height: 0.8mm; Dielectric: X5R; Width: 0.8mm; Length: 1.6mm; ComponentLink1URL: https://datasheet.ciiva.com/46444/1769893-46444975.pdf?src-supplier=Element14
C119 C124 = CMP-108-000014-5: CAP CER 1UF 25V X5R 0402 10%; Manufacturer 1: Murata; ComponentLink2Description: https://datasheet.ciiva.com/7719/1666664-7719006.pdf?src-supplier=Element14; ComponentLink2URL: https://datasheet.ciiva.com/7719/1666664-7719006.pdf?src-supplier=Element14; Max Operating Temperature: 85°C; Depth: 0.5mm; Mounting Technology: SMT; ComponentLink1URL: https://datasheet.ciiva.com/22732/1666664-22732122.pdf?src-supplier=Element14; Length: 1mm; ComponentLink1Description: https://datasheet.ciiva.com/22732/1666664-22732122.pdf?src-supplier=Element14; Manufacturer Part Number 1: GRM155R61E105KA12D; Tolerance: 10%; Design Item ID: GRM155R61E105KA12D; Dielectric: X5R; Min Operating Temperature: -55°C; Height: 0.5mm; Width: 0.5mm
  C119: Case/Package: 0402
C120 = CMP-001-00121-3: CAP CER 100UF 10V X5R 1210 20%; Manufacturer 1: Kemet; Capacitor Type: Ceramic; Manufacturer Part Number 1: C1210C107M8PACTU; Mounting Technology: SMT; Dielectric: X5R; Tolerance: 20%; Min Operating Temperature: -55°C; Case/Package: 1210; Voltage Rating: 10V; Max Operating Temperature: 85°C
C121 = GRM155R71A104JA01D: CAP CER 0.1UF 10V X7R 0402 5%; Manufacturer 1: Murata; Capacitance: 100nF; Supplier 1: Digi-Key; Manufacturer Part Number 1: GRM155R71A104JA01D; Stock 1: 1346709; Pricing 1: 1=0.10000, 10=0.02500, 100=0.01130, 500=0.00806, 1000=0.00633, 2500=0.00575, 5000=0.00529 (USD); RoHS: Yes; Mount: Surface Mount; Case/Package: 0402; Case Code (Imperial): 0402; Case Code (Metric): 1005; Min Operating Temperature: -55°C; Max Operating Temperature: 125°C; Tolerance: 5%; Packaging: Tape and Reel; Voltage Rating (DC): 10V; Dielectric: X7R; Package Quantity: 10000; Termination: SMD/SMT; Length: 1mm; Height: 0.5mm; Width: 0.02inch; Thickness: 0.022inch; Depth: 0.5mm; Radiation Hardening: No; Lead Free: Lead Free; ComponentLink1URL: https://datasheet.ciiva.com/5411/product-5411135.pdf?src-supplier=Mouser; ComponentLink1Description: https://datasheet.ciiva.com/5411/product-5411135.pdf?src-supplier=Mouser; ComponentLink2URL: https://datasheet.ciiva.com/11618/c02e-11618821.pdf?src-supplier=Avnet; ComponentLink2Description: https://datasheet.ciiva.com/11618/c02e-11618821.pdf?src-supplier=Avnet; Supplier Part Number 1: 490-10777-1-ND
C125 = CMP-108-000002-6: CAP CER 0.1UF 16V X7R 0402 10%; Manufacturer 1: Samsung; ComponentLink1URL: https://datasheet.ciiva.com/25767/cl05b104ko5nfnc-25767124.pdf?src-supplier=Digi-Key; Length: 1mm; Design Item ID: CL05B104KO5NFNC; Tolerance: 10%; Min Operating Temperature: -55°C; Width: 0.02inch; Dielectric: X7R; ComponentLink1Description: https://datasheet.ciiva.com/25767/cl05b104ko5nfnc-25767124.pdf?src-supplier=Digi-Key; Height: 0.5mm; Depth: 0.5mm; Manufacturer Part Number 1: CL05B104KO5NFNC; Max Operating Temperature: 125°C; Mounting Technology: SMT
D20 = CMP-004-00064-2: Trans Voltage Suppressor Diode, 450W, 5V V(RWM), Unidirectional, 1 Element; Manufacturer 1: Littelfuse; Manufacturer Part Number 1: SD05-01FTG; VBR: 5V
Q1 = CMP-016-000020-2: MOSFET P-CH 20V 6.9A 6TSOP; Manufacturer 1: Infineon; Max Drain to Source Voltage: -20V; Case/Package: TSOP; Manufacturer Part Number 1: IRLTS2242TRPBF; Design Item ID: IRLTS2242TRPBF; Continuous Drain Current: 6.9A
Q19 = CMP-061-000004-2: Trench Power MOSFET, -20 V, -4.2 A, Single P-Channel, 6-Pin SC70, Pb-Free, Tape and Reel; Manufacturer 1: ON Semiconductor; PD Max (W): 1; Continuous Drain Current: 4.2A; Transistor Type: P Channel; Mounting Technology: Surface Mount; PartNumber: NTJS4151PT1G; Manufacturer Part Number 1: NTJS4151PT1G; Design Item ID: NTJS4151PT1G
R1 R136 = CMP-009-00008-13: RES SMD 0 OHM 5% 0.25W 1206; Manufacturer 1: Panasonic; Power Rating: 250mW; Voltage Rating: 200V; Manufacturer Part Number 1: ERJ8GEY0R00V; Max Operating Temperature: 155°C; Tolerance: 5%; Min Operating Temperature: -55°C
R2 R3 R106 = CMP-013-000035-8: RES SMD 100K OHM 1% 1/16W 0402; Manufacturer 1: Yageo; Power Rating: 63mW; Voltage Rating: 50V; Design Item ID: RC0402FR-07100KL; Max Operating Temperature: 155°C; Min Operating Temperature: -55°C; Tolerance: 1%; Manufacturer Part Number 1: RC0402FR-07100KL
R137 = CMP-013-000029-9: RES SMD 470 OHM 1% 1/16W 0402; Manufacturer 1: Vishay; Voltage Rating: 50V; Power Rating: 63mW; Max Operating Temperature: 155°C; Min Operating Temperature: -55°C; Tolerance: 1%; Design Item ID: CRCW0402470RFKED; Manufacturer Part Number 1: CRCW0402470RFKED
R138 = CMP-013-000001-9: RES SMD 17.8K OHM 1% 1/10W 0402; Manufacturer 1: Panasonic; Power Rating: 100mW; Voltage Rating: 50V; Design Item ID: ERJ-2RKF1782X; Tolerance: 1%; Max Operating Temperature: 155°C; Manufacturer Part Number 1: ERJ-2RKF1782X; Min Operating Temperature: -55°C
TP1 TP2 TP6 = CMP-015-000000-2: Manufacturer Part Number 1: /; Source: LuxonisMaster.SchLib; Design Item ID: TEST_POINT
U1 = CMP-099-000001-2: IC OR CTRLR IDEAL DIODE SC70-6; Manufacturer 1: Texas Instruments; Manufacturer Part Number 1: LM66100DCKR
U23 = CMP-019-00050-2: Single Channel Power Distribution Load Switch, -40 to 85°C, Rohs; Manufacturer 1: Diodes Incorporated; Vfb/Vout: 0V; Max Output Current: 0A; Manufacturer Part Number 1: AP22814AW5-7; Case/Package: SOT-25

## Sheet Level_shifter.SchDoc: =project_title
size Tabloid; CompanyName: Luxonis Holding; DrawnBy: Eason Lin; Organization: Luxonis Holding; Address1: 1925 Harmony Park Drive; Address2: Westminster, CO; Address3: 80234; Address4: United States; DocumentNumber: D2088000; Revision: R1M1E2; SheetNumber: 7; SheetTotal: 8
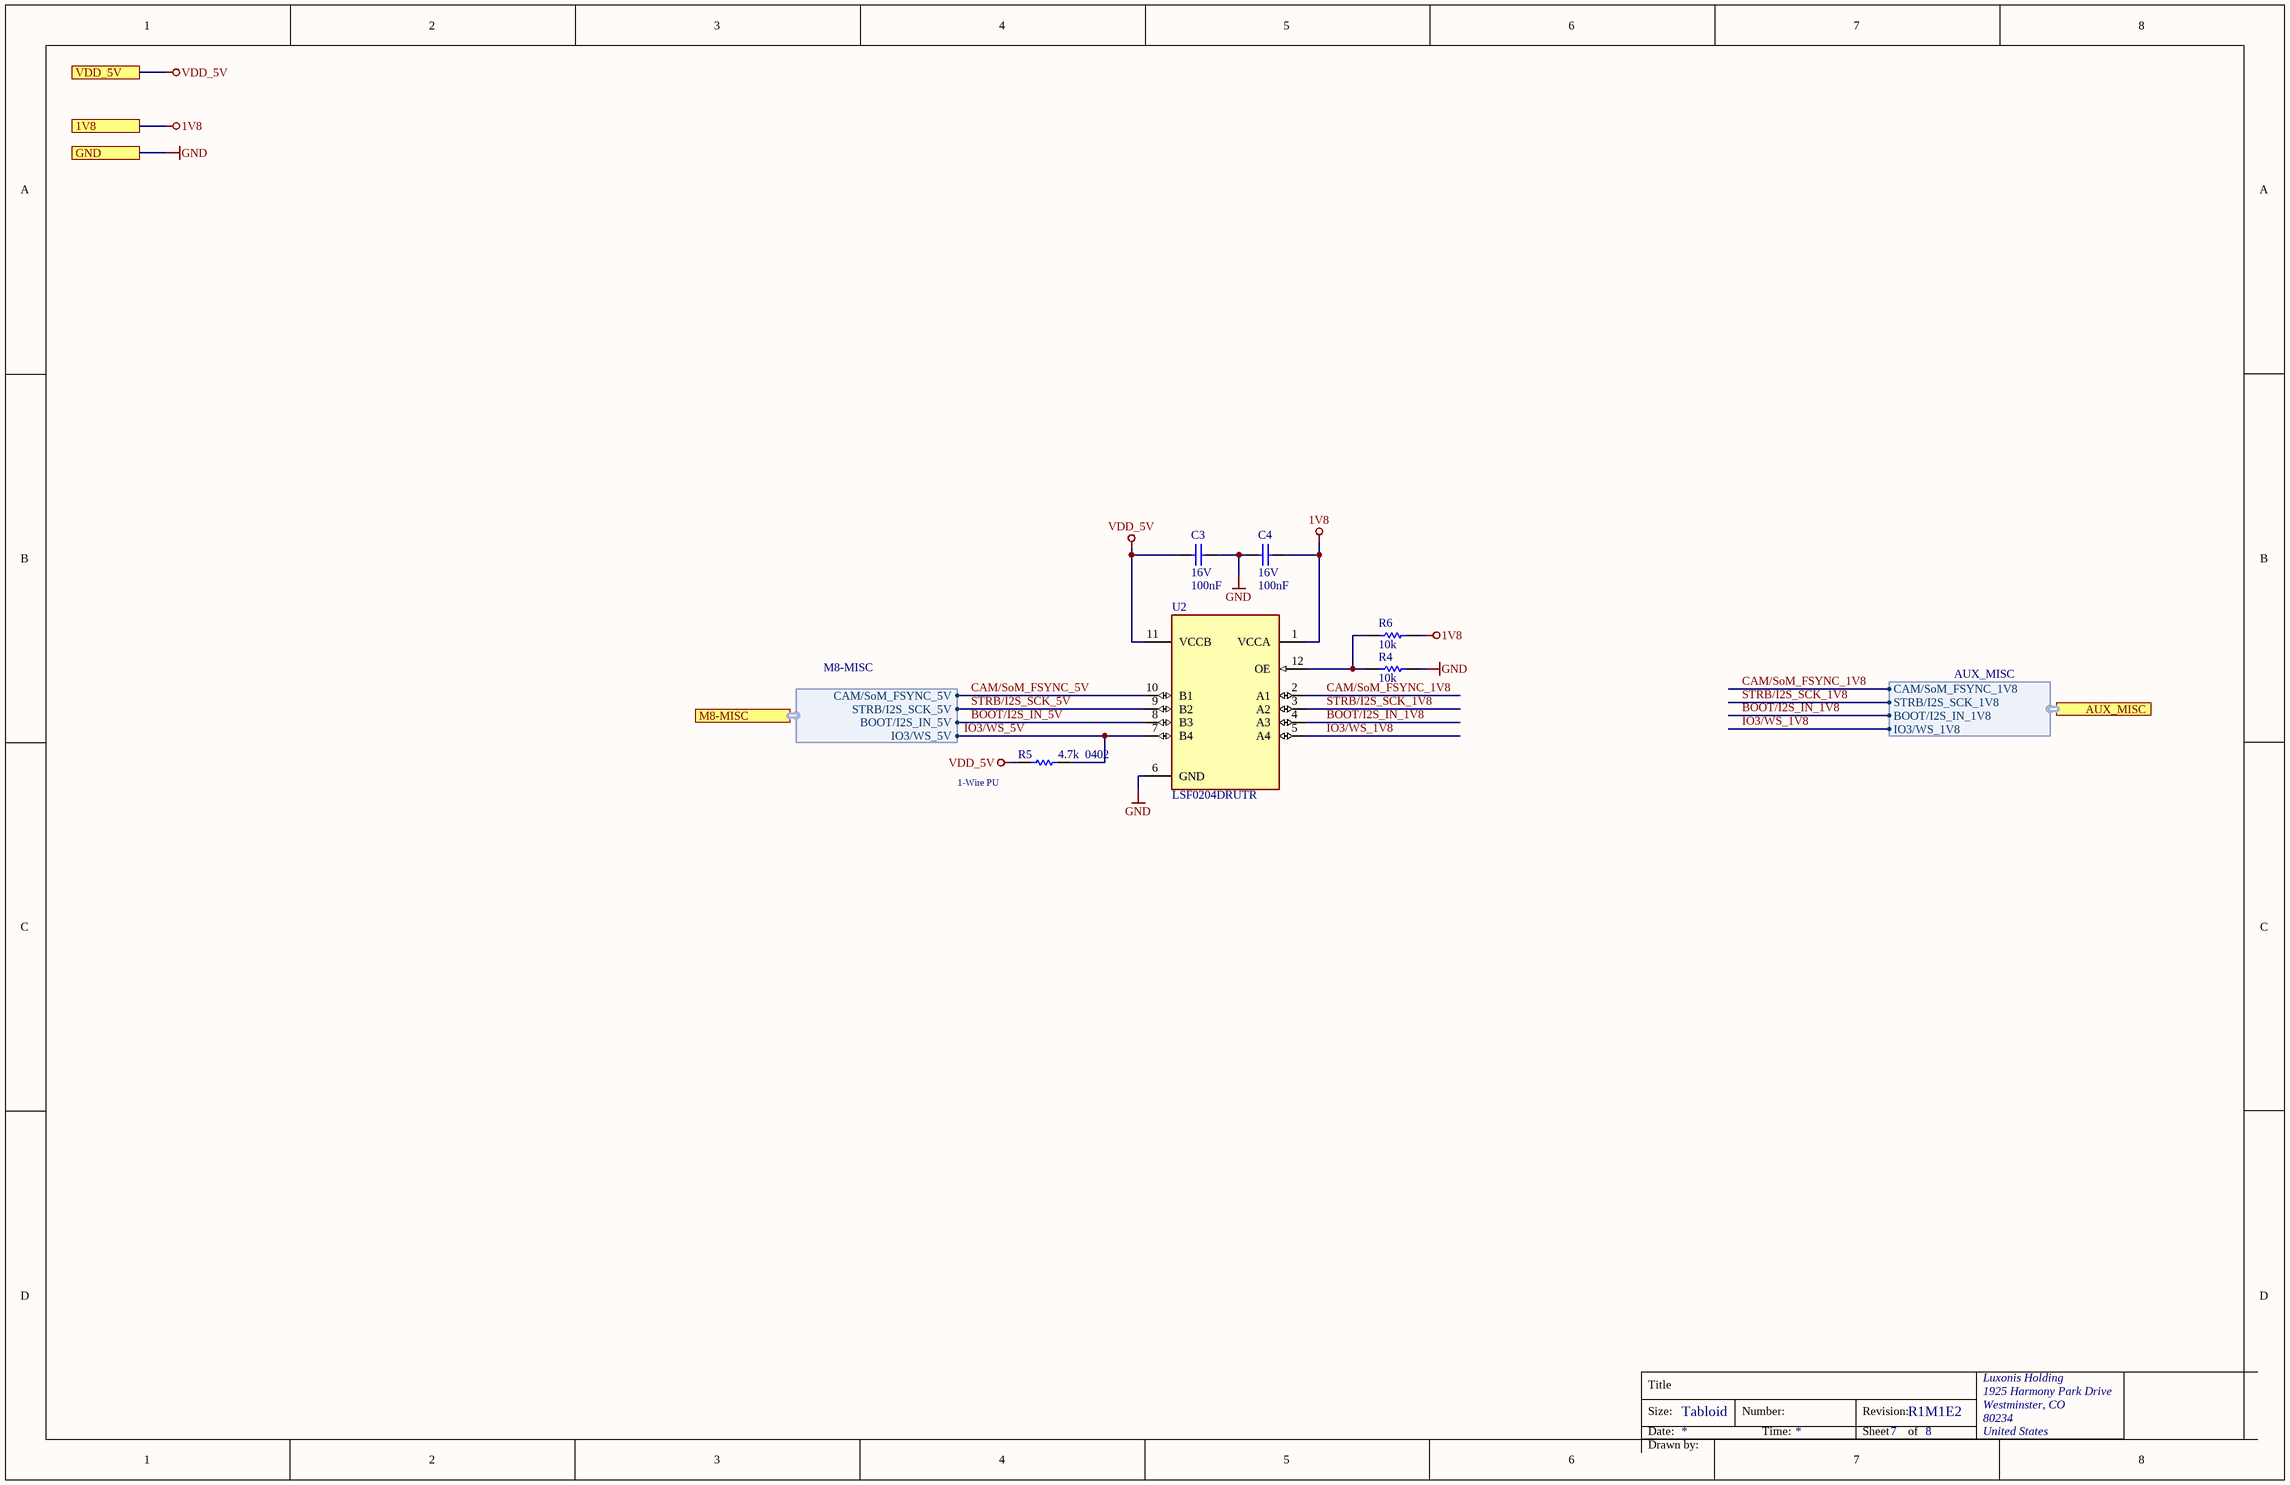
[diagram p7: Level_shifter.SchDoc]

### Parts
C3  value 100nF  Voltage Rating: 16V  [CAPC0402(1005)60_N]  (hidden comment: CL05B104KO5NFNC)
C4  value 100nF  Voltage Rating: 16V  [CAPC0402(1005)60_N]  (hidden comment: CL05B104KO5NFNC)
R4  value 10k  [RESC0402(1005)_N]  (hidden comment: RC0402FR-1310KL)
R5  value 4.7k  Case/Package: 0402  [RESC0402(1005)_N]  (hidden comment: RC0402FR-074K7L)
R6  value 10k  [RESC0402(1005)_N]  (hidden comment: RC0402FR-1310KL)
U2  LSF0204DRUTR  [LSF0204DRUTR]

### Ports
1V8, AUX_MISC (harness AUX_MISC), GND, M8-MISC (harness M8-MISC), VDD_5V

### Harnesses
AUX_MISC: CAM/SoM_FSYNC_1V8, STRB/I2S_SCK_1V8, BOOT/I2S_IN_1V8, IO3/WS_1V8
M8-MISC: CAM/SoM_FSYNC_5V, STRB/I2S_SCK_5V, BOOT/I2S_IN_5V, IO3/WS_5V

### Nets
1V8: C4.2 R6.2 U2.1(VCCA) ; port 1V8
GND: C3.2 C4.1 R4.2 U2.6(GND) ; port GND
VDD_5V: C3.1 R5.1 U2.11(VCCB) ; port VDD_5V
BOOT/I2S_IN_1V8: U2.4(A3) ; port AUX_MISC.BOOT/I2S_IN_1V8
BOOT/I2S_IN_5V: U2.8(B3) ; port M8-MISC.BOOT/I2S_IN_5V
CAM/SoM_FSYNC_1V8: U2.2(A1) ; port AUX_MISC.CAM/SoM_FSYNC_1V8
CAM/SoM_FSYNC_5V: U2.10(B1) ; port M8-MISC.CAM/SoM_FSYNC_5V
IO3/WS_1V8: U2.5(A4) ; port AUX_MISC.IO3/WS_1V8
IO3/WS_5V: R5.2 U2.7(B4) ; port M8-MISC.IO3/WS_5V
STRB/I2S_SCK_1V8: U2.3(A2) ; port AUX_MISC.STRB/I2S_SCK_1V8
STRB/I2S_SCK_5V: U2.9(B2) ; port M8-MISC.STRB/I2S_SCK_5V
NetR4_1: R4.1 R6.1 U2.12(OE)

### Notes on the sheet
- (near R5) 1-Wire PU
- Title
- Size:
- Date:
- Tabloid
- Number:
- Time:
- Revision:
- Sheet
- of
- Drawn by:

### Library data of the parts
C3 C4 = CMP-108-000002-6: as C125 on sheet POWER CONTROL; Dielectric: X7R; Mounting Technology: SMT; Width: 0.02inch; Design Item ID: CL05B104KO5NFNC; Tolerance: 10%; Length: 1mm; Case/Package: 0402; ComponentLink1URL: https://datasheet.ciiva.com/25767/cl05b104ko5nfnc-25767124.pdf?src-supplier=Digi-Key; Depth: 0.5mm; Min Operating Temperature: -55°C; Manufacturer Part Number 1: CL05B104KO5NFNC; ComponentLink1Description: https://datasheet.ciiva.com/25767/cl05b104ko5nfnc-25767124.pdf?src-supplier=Digi-Key; Height: 0.5mm; Max Operating Temperature: 125°C
R4 R6 = CMP-115-000004-8: RES SMD 10K OHM 1% 1/16W 0402; Manufacturer 1: Yageo; Power Rating: 62.5mW; Temperature Coefficient: 100ppm/°C; Voltage Rating: 50V; Tolerance: 1%; Max Operating Temperature: 155°C; Case/Package: 0402; Manufacturer Part Number 1: RC0402FR-1310KL; Min Operating Temperature: -55°C; Design Item ID: RC0402FR-1310KL
R5 = CMP-013-000016-9: RES SMD 4.7K OHM 1% 1/16W 0402; Manufacturer 1: Yageo; Power Rating: 62.5mW; Voltage Rating: 50V; Min Operating Temperature: -55°C; Manufacturer Part Number 1: RC0402FR-074K7L; Tolerance: 1%; Design Item ID: RC0402FR-074K7L; Max Operating Temperature: 155°C
U2 = CMP-362-000000-2: Voltage Level Translator Bidirectional 1 Circuit 4 Channel 100Mbps 12-UQFN _1.7x2_; Manufacturer 1: TI; MF: Texas Instruments; Manufacturer Part Number 1: LSF0204DRUTR; Case/Package: QCCN; MP: LSF0204DRUTR; Package: UQFN-12 Texas Instruments; Pins: 12

## Nets that join several sheets
1V8: BTB_CONN (J1.30 TP3.1), Level_shifter (C4.2 R6.2 U2.1)
5V_PoE: POE_SI3404 (7 pins), POWER CONTROL (5 pins)
GND: M12_ETH_CONN (C50.1 C55.1 J8.9), POE_SI3404 (9 pins), M8_AUX_CONN (8 pins), BTB_CONN (9 pins), POWER CONTROL (10 pins), Level_shifter (C3.2 C4.1 R4.2 U2.6)
VBUSIN: M8_AUX_CONN (J12.5), POWER CONTROL (9 pins)
VDD_5V: BTB_CONN (5 pins), POWER CONTROL (C119.2 R1.2 U23.5), Level_shifter (C3.1 R5.1 U2.11)
VNEG_IN: M12_ETH_CONN (D5.4 D6.4), POE_SI3404 (C94.1 FB10.1)
BOOT/I2S_IN_1V8: BTB_CONN (J1.24), Level_shifter (U2.4)
BOOT/I2S_IN_5V: M8_AUX_CONN (D1.1 J12.1), Level_shifter (U2.8)
CAM/SoM_FSYNC_1V8: BTB_CONN (J1.26), Level_shifter (U2.2)
CAM/SoM_FSYNC_5V: M8_AUX_CONN (D1.5 J12.2), Level_shifter (U2.10)
IO3/WS_1V8: BTB_CONN (J1.23), Level_shifter (U2.5)
IO3/WS_5V: M8_AUX_CONN (D1.4 J12.7), Level_shifter (R5.2 U2.7)
MD1_N: M12_ETH_CONN (J7.3), BTB_CONN (J1.3)
MD1_P: M12_ETH_CONN (J7.2), BTB_CONN (J1.2)
MD2_N: M12_ETH_CONN (J7.6), BTB_CONN (J1.6)
MD2_P: M12_ETH_CONN (J7.5), BTB_CONN (J1.5)
MD3_N: M12_ETH_CONN (J7.9), BTB_CONN (J1.9)
MD3_P: M12_ETH_CONN (J7.8), BTB_CONN (J1.8)
MD4_N: M12_ETH_CONN (J7.12), BTB_CONN (J1.12)
MD4_P: M12_ETH_CONN (J7.11), BTB_CONN (J1.11)
STRB/I2S_SCK_1V8: BTB_CONN (J1.25), Level_shifter (U2.3)
STRB/I2S_SCK_5V: M8_AUX_CONN (D1.3 J12.6), Level_shifter (U2.9)
USB_D_N: M8_AUX_CONN (D15.2 D15.9 J12.4), BTB_CONN (J1.21)
USB_D_P: M8_AUX_CONN (D15.1 D15.10 J12.3), BTB_CONN (J1.20)
VBUS_SRC_EN_1V8: BTB_CONN (J1.28), POWER CONTROL (R106.1 U23.4)
VPOS_IN: M12_ETH_CONN (D5.1 D6.1), POE_SI3404 (C94.2 FB9.1)

## Assembly variants
Production_MX: not fitted C124 R3 R6 R136
Production_KB: not fitted C124 R3 R6 R136